# Altium schematic sheet REMS.SchDoc
size A4; SheetNumber: 1; SheetTotal: 1; SPICEModelCacheBBDBGFQJ: <root> / <DocumentId>BBDBGFQJ</DocumentId> / <CacheFrame Number="0"> / <Model Name="led2" Kind="MDL"> / <Text>*Typ RED,GREEN,YELLOW,AMBER GaAs LED: Vf=2.1V Vr=4V If=40mA trr=3uS / *LED Pinout: 1=A, 2=K / .MODEL LED2 D (IS=93.1P RS=42M N=4.61 BV=4 IBV=10U / + CJO=2.97P VJ=.75 M=.333 TT=4.32U)</Text> / </Model> / <Model Name="xtal" Kind="CKT"> / <Text>*Generic type:crystal pkg:HC33/51 / .SUBCKT XTAL 1 2 PARAMS: FREQ=1Meg RS=750 C=13pf Q=1000 / LX 1 3 {((Q*RS)/(6.2831852*FREQ))} IC=0.5M / CX 3 4 {(1/(Q*6.2831852*FREQ*RS))} / C0 1 2 {C} / RS 4 2 {RS} / .ENDS XTAL</Text> / </Model> / </CacheFrame> / </root>
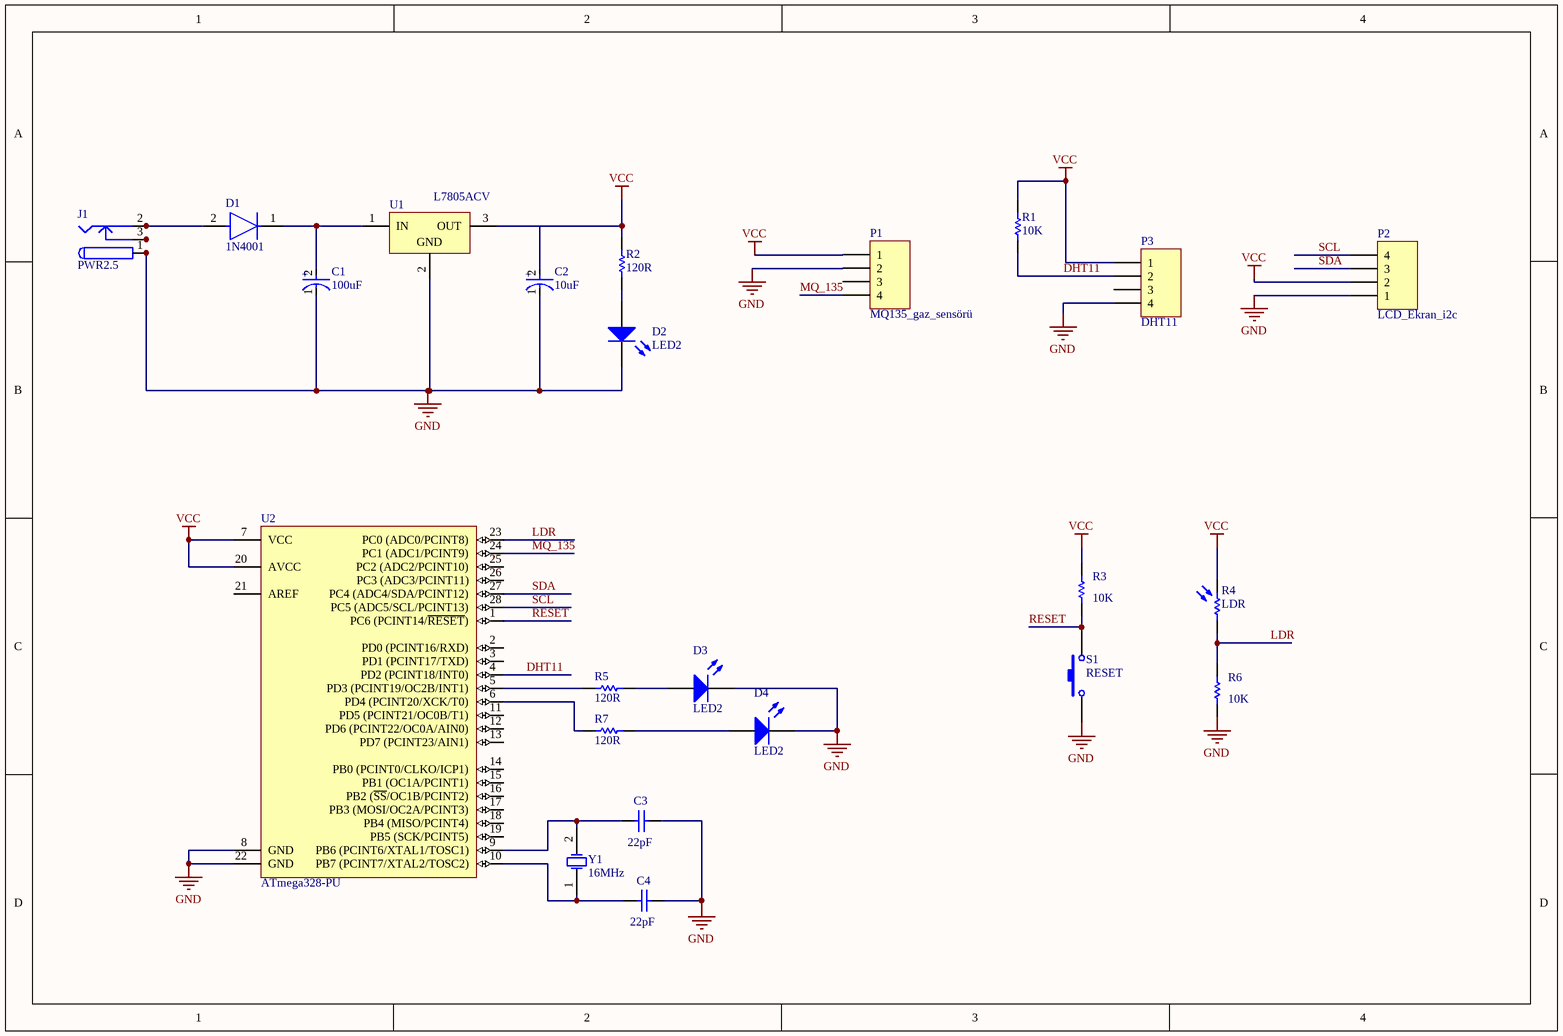
[diagram p0: REMS.SchDoc]

## Parts
C1  100uF  [FP-RAD-TH-D_8_0_5-L_15_1-MFG]
C2  10uF  [FP-RAD-TH-D_5_0_5-L_11_1-MFG]
C3  22pF  [mercimek]
C4  22pF  [mercimek]
D1  1N4001  [FP-DO-41-MFG]
D2  LED2  [3.2X1.6X1.1]
D3  LED2  [3.2X1.6X1.1]
D4  LED2  [3.2X1.6X1.1]
J1  PWR2.5  [DC soket]
P1  MQ135_gaz_sensörü  [MQ_SENSOR]
P2  LCD_Ekran_i2c  [MQ_SENSOR]
P3  DHT11  [DHT11_dik]
R1  10K  [direnc_axial_0.4]
R2  120R  [direnc_axial_0.4]
R3  10K  [direnc_axial_0.4]
R4  LDR  [EXCE-VT90N1]
R5  120R  [direnc_axial_0.4]
R6  10K  [direnc_axial_0.4]
R7  120R  [direnc_axial_0.4]
S1  RESET  [pushButton5mm]
U1  L7805ACV  [TO220]
U2  ATmega328-PU  [28P3]
Y1  16MHz  [xtal]

## Nets
GND: C1.1(C) C2.1(C) C3.2 C4.2 D2.2(K) D3.2(K) D4.2(K) J1.1 J1.1A J1.1B P1.2 P2.1 P3.4 R6.1 S1.1 U1.2(GND) U2.8(GND) U2.22(GND)
VCC: C2.2(A) P1.1 P2.2 P3.1 R1.1 R2.1 R3.2 R4.2 U1.3(OUT) U2.7(VCC) U2.20(AVCC)
DHT11: P3.2 R1.2 U2.4(PD2_(PCINT18/INT0))
LDR: R4.1 R6.2 U2.23(PC0_(ADC0/PCINT8))
MQ_135: P1.4 U2.24(PC1_(ADC1/PCINT9))
RESET: R3.1 S1.2 U2.1(PC6_(PCINT14/~{RESET}))
SCL: P2.4 U2.28(PC5_(ADC5/SCL/PCINT13))
SDA: P2.3 U2.27(PC4_(ADC4/SDA/PCINT12))
NetC1_2: C1.2(A) D1.1(C) U1.1(IN)
NetC3_1: C3.1 U2.9(PB6_(PCINT6/XTAL1/TOSC1)) Y1.2(OSC2)
NetC4_1: C4.1 U2.10(PB7_(PCINT7/XTAL2/TOSC2)) Y1.1(OSC1)
NetD1_2: D1.2(A) J1.2 J1.2A J1.2B
NetD2_1: D2.1(A) R2.2
NetD3_1: D3.1(A) R5.2
NetD4_1: D4.1(A) R7.2
NetJ1_3: J1.3 J1.3A J1.3B
NetR5_1: R5.1 U2.5(PD3_(PCINT19/OC2B/INT1))
NetR7_1: R7.1 U2.6(PD4_(PCINT20/XCK/T0))

Not connected (* = marked no-connect by the designer): P1 3; P3 3; U2 2(PD0_(PCINT16/RXD)) 3(PD1_(PCINT17/TXD)) 11(PD5_(PCINT21/OC0B/T1)) 12(PD6_(PCINT22/OC0A/AIN0)) 13(PD7_(PCINT23/AIN1)) 14(PB0_(PCINT0/CLKO/ICP1)) 15(PB1_(OC1A/PCINT1)) 16(PB2_(~{SS}/OC1B/PCINT2)) 17(PB3_(MOSI/OC2A/PCINT3)) 18(PB4_(MISO/PCINT4)) 19(PB5_(SCK/PCINT5)) 21(AREF) 25(PC2_(ADC2/PCINT10)) 26(PC3_(ADC3/PCINT11))

## Notes on the sheet
- (in symbol CMP-05427-000276-1) +
- (in symbol CMP-05427-001517-1) +

## Library data of the parts
C1 = CMP-05427-000276-1: Aluminum Electrolytic Capacitors (Radial Lead Type) 100uF ±20% 63V; Ripple Current: 741mA; Impedance: 68mR; Lead Diameter: 0.6mm; Life (Hours): 8000Hour; Diameter: 8mm; Lead Free: Lead Free; Packaging: Tape and Reel; Height - Seated (Max): 0.65inch; Height: 15mm; Case/Package: Radial; Radiation Hardening: No; RoHS Compliant: Yes; Termination: Radial; Voltage Rating: 63V; Lead Pitch: 5mm; ESR (Equivalent Series Resistance): 68mR; Series: FR; Max Operating Temperature: 105°C; Tolerance: 20%; Mount: Through Hole; REACH SVHC: Yes; Package Quantity: 1; Min Operating Temperature: -40°C; Voltage Rating (DC): 63V; Length: 15mm; Capacitance: 100uF
C2 = CMP-05427-001517-1: Aluminum Electrolytic Capacitors (Radial Lead Type) 10uF ±20% 63V; Life (Hours): 2000Hour; Dielectric Material: Aluminium; Lead/Base Style: Straight; Ripple Current: 70mA; Dissipation Factor: 0.11%; Leakage Current: 3uA; Lead Diameter: 0.5mm; Max Operating Temperature: 85°C; Capacitance: 10uF; Voltage Rating: 63V; Packaging: Bulk; Radiation Hardening: No; Tolerance: 20%; Height: 11mm; Mount: Through Hole; Voltage: 63V; Voltage Rating (DC): 63V; Lead Pitch: 2mm; RoHS Compliant: Yes; Diameter: 5mm; Package Quantity: 200; Length: 11mm; Case/Package: Radial; Min Operating Temperature: -40°C; Construction: RADIAL; Height - Seated (Max): 0.472inch; Lead Free: Lead Free; Termination: Radial; Width: 5mm; Series: M; REACH SVHC: No SVHC
C3 C4 = Cap: Capacitor; Published: 8-Jun-2000; LatestRevisionDate: 17-Jul-2002; LatestRevisionNote: Re-released for DXP Platform.; PackageReference: RAD-0.3; Publisher: Altium Limited; PackageDescription: Radial Cap, Thru-Hole; 2 Leads; 0.3 in Pin Spacing; Value: 22pF
D1 = CMP-56207-000001-1: DIODE GEN PURP 50V 1A DO41; Manufacturer Part Number: 1N4001-TP; Manufacturer: Micro Commercial; Max Surge Forward Current: 30A; Max Junction Temp: +150°C; Capacitance: 15pF; Peak Reverse Current: 5uA; Value: 15pF; Height: 2.7mm; Device Class L3: Rectifier Diodes; Octopart: https://octopart.com/1n4001-tp-mcc-730241; ComponentLink2URL: http://www.mccsemi.com/up_pdf/1N4001-1N4007(DO-41).pdf; ComponentLink2Description: Datasheet; Reverse Voltage: 50V; Lead Free: Yes; Temperature: -55°C to +150°C; Forward Current: 1A; RoHS: TRUE; Temperature Range Low: -55°C; Package: DO-41; Category: Diode; Temperature Range High: +150°C; Digikey Description: DIODE GEN PURP 50V 1A DO41; Ipc Land Pattern Name: DIOPA1114W105L520D270; Mouser Description: Rectifiers Vr/50V Io/1A; Max Repetitive Reverse Voltage: 50V; Device Class L1: Discrete Semiconductors; Automotive: No; Device Class L2: Diodes
D2-D4 = LED2: Typical RED, GREEN, YELLOW, AMBER GaAs LED; Published: 8-Jun-2000; LatestRevisionDate: 17-Jul-2002; LatestRevisionNote: Re-released for DXP Platform.; PackageVersion: Feb-2002; PackageReference: 3.2X1.6X1.1; Publisher: Altium Limited; PackageDescription: SM LED; 2 Flat Leads
J1 = PWR2.5: Low Voltage Power Supply Connector; Published: 17-Dec-2003; DatasheetDocument: 09-May-2002; Publisher: Altium Limited; ComponentLink1Description: Manufacturer Link; ComponentLink1URL: http://domino.kycon.com/internet/Products.html
P1-P3 = MHDR1X4: Header, 4-Pin; LatestRevisionDate: 17-Jul-2002; LatestRevisionNote: Re-released for DXP Platform.; Publisher: Altium Limited
R1-R3 R5-R7 = Res1: Resistor; Published: 8-Jun-2000; LatestRevisionDate: 17-Jul-2002; LatestRevisionNote: Re-released for DXP Platform.; PackageReference: AXIAL-0.3; Publisher: Altium Limited; PackageDescription: Axial Device, Thru-Hole; 2 Leads; 0.3 in Pin Spacing
  R1 R3 R6: Value: 10K
  R2 R5 R7: Value: 120R
R4 = CMP-2000-07406-1: Photoconductive Resistor, 200 kOhm, 100 V, 80 mW, -40 to 75 degC, 2-Pin THD, RoHS; Manufacturer: Excelitas Technology; SVHC: Cadmiumchloride(15-Jun-2015); Power Rating: 80mW; Resistance @ Lux: 12kohm; Voltage Rating: 100V; Product Range: -; Datasheet Version: 09/2006; Resistor Case Style: -; Operating Temperature Max: 75°C; Package Reference: VT90N1; Datasheet URL: http://datasheet.octopart.com/VT90N1-Excelitas-datasheet-10388451.pdf; Mounting Technology: ThroughHole; Operating Temperature Min: -40°C; Dark Resistance: 200kohm; Package Description: 2-Pin Through Hole Device, Body Width 4.17 mm (Max), Height 2.29 mm; Manufacturer URL: http://www.excelitas.com/Pages/Index.aspx; Packaging: Each
S1 = SW-PB: Switch; Published: 24-Mar-1999; LatestRevisionDate: 17-Jul-2002; LatestRevisionNote: Re-released for DXP Platform.; PackageReference: SPST-2; Publisher: Altium Limited; PackageDescription: Switch; 2 Leads
U1 = CMP-0244-00484-1: Positive Voltage Regulator, 5V, 3-Pin TO-220; DatasheetVersion: 16/11/2011; ComponentLink2Description: Datasheet; ComponentLink3Description: Package Specification; ComponentLink2URL: http://www.st.com/internet/com/TECHNICAL_RESOURCES/TECHNICAL_LITERATURE/DATASHEET/CD00000444.pdf; PackageDescription: TO, Thru-Hole, Vertical, Heatsink Mounted; 3 In-Line Leads; Pitch 2.54 mm; ComponentLink3URL: http://www.st.com/internet/com/TECHNICAL_RESOURCES/TECHNICAL_LITERATURE/PACKAGE_INFORMATION/CD00004649.pdf; PackageReference: TO220; ComponentLink1URL: http://www.st.com; PackageVersion: ver3.0; ComponentLink1Description: Manufacturer URL
U2 = CMP-0095-00015-2: 8-bit AVR Microcontroller, 32KB Flash, 1KB EEPROM, 2KB SRAM, 28-pin PDIP, Industrial Grade (-40°C to 85°C); ComponentLink3Description: ATmega48A/48PA/88A/88PA/168A/168PA/328/328P Summary; RevisionNote: DatasheetVersion updated. URLs added.; DatasheetVersion: revD, May-2011; ComponentLink1URL: http://www.atmel.com/; PackageVersion: revB, Sep-2001; PackageDescription: 28-lead (0.300"/7.62mm Wide) Plastic Dual Inline Package (PDIP); PackageReference: 28P3; ComponentLink1Description: Manufacturer URL; ComponentLink2Description: ATmega48A/48PA/88A/88PA/168A/168PA/328/328P Datasheet; ComponentLink3URL: http://www.atmel.com/dyn/resources/prod_documents/8271S.pdf; ComponentLink2URL: http://www.atmel.com/dyn/resources/prod_documents/8271.pdf
Y1 = XTAL: Crystal Oscillator; Published: 8-Jun-2000; LatestRevisionDate: 17-Jul-2002; LatestRevisionNote: Re-released for DXP Platform.; PackageReference: R38; Publisher: Altium Limited; PackageDescription: Crystal, Thru-Hole; 2 Leads; Body 3.1 x 8.2 mm (Dia.xH)